# EAGLE design xenon_mini (EAGLE 9.4.2)
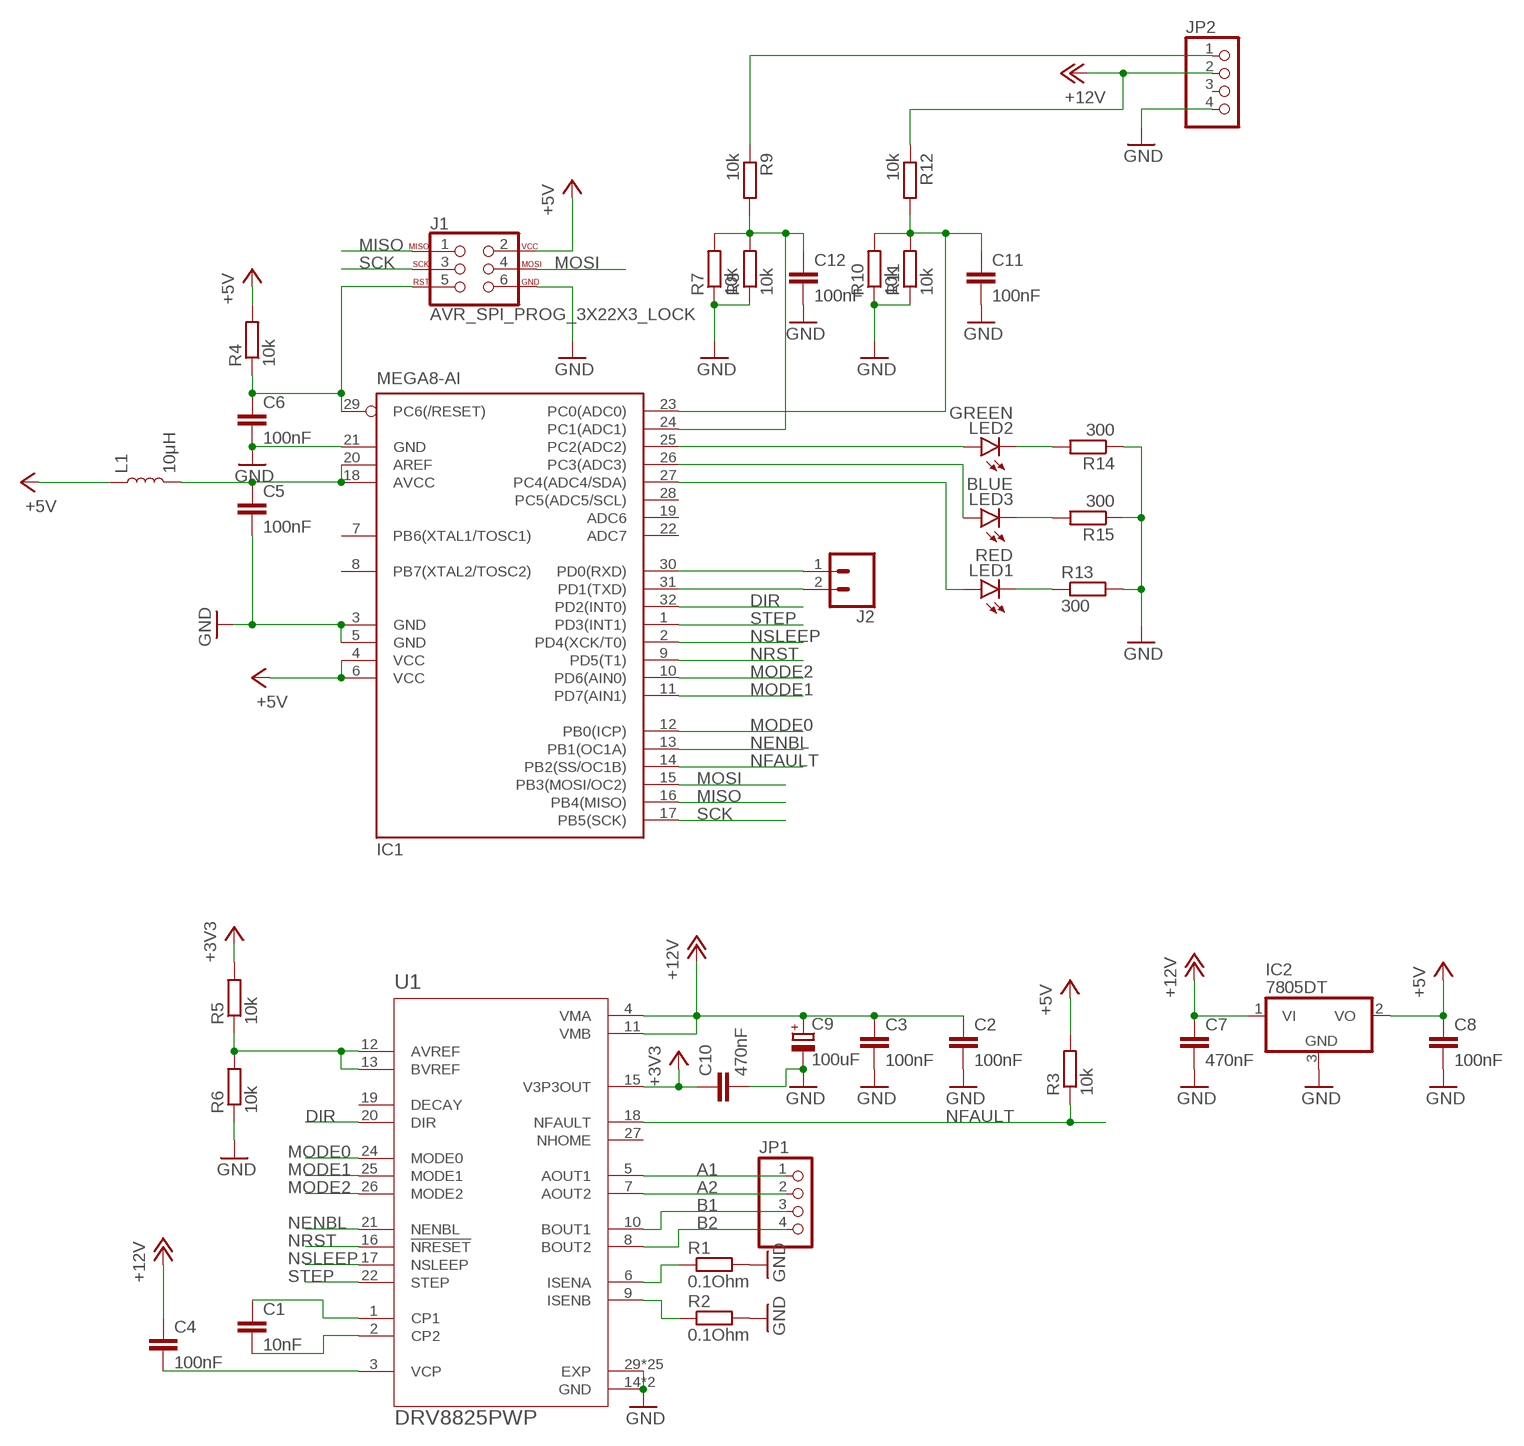
[diagram p0: schematic, sheet 1]

## Parts
C1  10nF  C-EUC0603  [C0603]
C2  100nF  C-EUC0603  [C0603]
C3  100nF  C-EUC0603  [C0603]
C4  100nF  C-EUC0603  [C0603]
C5  100nF  C-EUC0603  [C0603]
C6  100nF  C-EUC0603  [C0603]
C7  470nF  C-EUC0603  [C0603]
C8  100nF  C-EUC0603  [C0603]
C9  100uF  CPOL-EUUD-6,3X7,7  [UD-6,3X7,7_NICHICON]
C10  470nF  C-EUC0603  [C0603]
C11  100nF  C-EUC0603  [C0603]
C12  100nF  C-EUC0603  [C0603]
IC1  MEGA8-AI  [TQFP32-08]
IC2  7805DT  [TO252]
J1  AVR_SPI_PROG_3X22X3_LOCK  [2X3_LOCK]
J2  CONN_02LOCK  [1X02_LOCK]
JP1  PINHD-1X4  [1X04]
JP2  PINHD-1X4  [1X04]
L1  10μH  10μH_SHIELDED_INDUCTOR0805  [0805]
LED1  RED  LEDSML0603  [SML0603]
LED2  GREEN  LEDSML0603  [SML0603]
LED3  BLUE  LEDSML0603  [SML0603]
R1  0.1Ohm  R-EU_R1206  [R1206]
R2  0.1Ohm  R-EU_R1206  [R1206]
R3  10k  R-EU_R0603  [R0603]
R4  10k  R-EU_R0603  [R0603]
R5  10k  R-EU_R0603  [R0603]
R6  10k  R-EU_R0603  [R0603]
R7  10k  R-EU_R0603  [R0603]
R8  10k  R-EU_R0603  [R0603]
R9  10k  R-EU_R0603  [R0603]
R10  10k  R-EU_R0603  [R0603]
R11  10k  R-EU_R0603  [R0603]
R12  10k  R-EU_R0603  [R0603]
R13  300  R-EU_R0603  [R0603]
R14  300  R-EU_R0603  [R0603]
R15  300  R-EU_R0603  [R0603]
U1  DRV8825PWP  [SOP65P640X120-29N]

## Nets
+3V3: C10.1 R5.2 U1.15(V3P3OUT)
+5V: C8.1 IC1.4(VCC) IC1.6(VCC) IC2.2(VO) J1.2 L1.1 R3.2 R4.2
+12V: C2.1 C3.1 C4.1 C7.1 C9.+ IC2.1(VI) JP2.2 R12.1 U1.4(VMA) U1.11(VMB)
A1: JP1.1 U1.5(AOUT1)
A2: JP1.2 U1.7(AOUT2)
B1: JP1.3 U1.10(BOUT1)
B2: JP1.4 U1.8(BOUT2)
DIR: IC1.32(PD2(INT0)) U1.20(DIR)
GND: C2.2 C3.2 C5.2 C6.2 C7.2 C8.2 C9.- C10.2 C11.2 C12.2 IC1.3(GND) IC1.5(GND) IC1.21(GND) IC2.3(GND) J1.6 JP2.4 R1.2 R2.2 R6.1 R7.1 R8.1 R10.1 R11.1 R13.2 R14.1 R15.1 U1.14(GND) U1.28(GND) U1.29(EXP) U1.P1(EXP) U1.P2(EXP) U1.P3(EXP) U1.P4(EXP) U1.P5(EXP) U1.P6(EXP) U1.P7(EXP) U1.P8(EXP) U1.P9(EXP) U1.P10(EXP) U1.P11(EXP) U1.P12(EXP) U1.P13(EXP) U1.P14(EXP) U1.P15(EXP) U1.P16(EXP) U1.P17(EXP) U1.P18(EXP) U1.P19(EXP) U1.P20(EXP) U1.P21(EXP) U1.P22(EXP) U1.P23(EXP) U1.P24(EXP)
MISO: IC1.16(PB4(MISO)) J1.1
MODE0: IC1.12(PB0(ICP)) U1.24(MODE0)
MODE1: IC1.11(PD7(AIN1)) U1.25(MODE1)
MODE2: IC1.10(PD6(AIN0)) U1.26(MODE2)
MOSI: IC1.15(PB3(MOSI/OC2)) J1.4
N$1: C1.1 U1.1(CP1)
N$2: C1.2 U1.2(CP2)
N$3: C4.2 U1.3(VCP)
N$4: R1.1 U1.6(ISENA)
N$5: R2.1 U1.9(ISENB)
N$6: C6.1 IC1.29(PC6(/RESET)) J1.5 R4.1
N$7: C12.1 IC1.24(PC1(ADC1)) R7.2 R8.2 R9.2
N$8: C11.1 IC1.23(PC0(ADC0)) R10.2 R11.2 R12.2
N$9: LED1.C R13.1
N$10: JP2.1 R9.1
N$11: R5.1 R6.2 U1.12(AVREF) U1.13(BVREF)
N$12: IC1.30(PD0(RXD)) J2.1
N$13: IC1.31(PD1(TXD)) J2.2
N$14: IC1.25(PC2(ADC2)) LED2.A
N$15: IC1.26(PC3(ADC3)) LED3.A
N$16: LED2.C R14.2
N$17: LED3.C R15.2
N$18: IC1.27(PC4(ADC4/SDA)) LED1.A
N$19: C5.1 IC1.18(AVCC) IC1.20(AREF) L1.2
NENBL: IC1.13(PB1(OC1A)) U1.21(NENBL)
NFAULT: IC1.14(PB2(SS/OC1B)) R3.1 U1.18(NFAULT)
NRST: IC1.9(PD5(T1)) U1.16(!NRESET)
NSLEEP: IC1.2(PD4(XCK/T0)) U1.17(NSLEEP)
SCK: IC1.17(PB5(SCK)) J1.3
STEP: IC1.1(PD3(INT1)) U1.22(STEP)
Unconnected: IC1.7(PB6(XTAL1/TOSC1)) IC1.8(PB7(XTAL2/TOSC2)) IC1.19(ADC6) IC1.22(ADC7) IC1.28(PC5(ADC5/SCL)) JP2.3 U1.19(DECAY) U1.27(NHOME)

## Library data of the parts
C1 = rcl:C-EU: CAPACITOR, European symbol; LCSC: C57112; SPICEPREFIX: C
C2-C4 C8 = rcl:C-EU: CAPACITOR, European symbol; LCSC: C14663; SPICEPREFIX: C
C5 C6 C11 C12 = rcl:C-EU: CAPACITOR, European symbol; LCSC: CC0603KRX7R9BB104; SPICEPREFIX: C
C7 C10 = rcl:C-EU: CAPACITOR, European symbol; LCSC: C1623; SPICEPREFIX: C
C9 = rcl:CPOL-EU: POLARIZED CAPACITOR, European symbol; LCSC: C176675; SPICEPREFIX: C
IC1 = atmel:MEGA8: MICROCONTROLLER 8 Kbytes FLASH, 1 kbytes SRAM, 512 bytes EEPROM, USART, 6-channel 10 bit ADC, 2-channel 8 bit ADC Pin compatible with Atmega48, ATMega88, ATMega168 Source: avr.lbr; LCSC: C8727; MPN: ATMEGA8-16AU; OC_FARNELL: 9171371; OC_NEWARK: 73M8863
IC2 = linear:78*: Positive VOLTAGE REGULATOR Source: http://cache.national.com/ds/LM/LM78L05.pdf http://www.fairchildsemi.com/ds/LM/LM7805.pdf; LCSC: C310413
J1 = SparkFun-Connectors:AVR_SPI_PROG_3X2: AVR ISP 6 Pin This is the reduced ISP connector for AVR programming. Common on Arduino. This footprint will take up less PCB space and can be used with a 10-pin to 6-pin adapter such as SKU: BOB-08508 **Special note about "TEST_POINT" package. The stop mask is on the top side, so if you want your programming test points to be on the bottom of your board, make sure to place this package on the bottom side of the board. This also ensure that the orientation to program from the bottom side will be correct. SparkFun Products: SparkFun ISP Pogo Adapter <https://www.sparkfun.com/products/11591> - NS Tiny AVR Programmer <https://www.sparkfun.com/products/11801> -PTH
J2 = SparkFun-Connectors:CONN_02: Multi connection point. Often used as Generic Header-pin footprint for 0.1 inch spaced/style header connections On any of the 0.1 inch spaced packages, you can populate with these: Break Away Headers - Straight <https://www.sparkfun.com/products/116> (PRT-00116) Break Away Male Headers - Right Angle <https://www.sparkfun.com/products/553> (PRT-00553) Female Headers <https://www.sparkfun.com/products/115> (PRT-00115) Break Away Headers - Machine Pin <https://www.sparkfun.com/products/117> (PRT-00117) Break Away Female Headers - Swiss Machine Pin <https://www.sparkfun.com/products/743> (PRT-00743) For SCREWTERMINALS and SPRING TERMINALS visit here: Screw Terimnals on SparkFun.com <https://www.sparkfun.com/search/results?term=Screw+Terminals> (5mm/3.5mm/2.54mm spacing) This device is also useful as a general connection point to wire up your design to another part of your project. Our various solder wires solder well into these plated through hole pads. Hook-Up Wire - Assortment (Stranded, 22 AWG) <https://www.sparkfun.com/products/11375> (PRT-11375) Hook-Up Wire - Assortment (Solid Core, 22 AWG) <https://www.sparkfun.com/products/11367> (PRT-11367) View the entire wire category on our website here <https://www.sparkfun.com/categories/141> Special notes: Molex polarized connector foot print use with: PRT-08233 with associated crimp pins and housings. 2.54_SCREWTERM for use with PRT-10571. 3.5mm Screw Terminal footprints for PRT-08084 5mm Screw Terminal footprints for use with PRT-08432
JP1 JP2 = pinhead:PINHD-1X4: PIN HEADER
L1 = SparkFun-Coils:10μH_SHIELDED_INDUCTOR: Murata 10uH Inductor 10uH 60mA 400mOhm 0805 Package Shielded; LCSC: C1046; PROD_ID: NDUC-13231
LED1 = led:LED: LED OSRAM: - CHIPLED LG R971, LG N971, LY N971, LG Q971, LY Q971, LO R971, LY R971 LH N974, LH R974 LS Q976, LO Q976, LY Q976 LO Q996 - Hyper CHIPLED LW Q18S LB Q993, LB Q99A, LB R99A - SideLED LS A670, LO A670, LY A670, LG A670, LP A670 LB A673, LV A673, LT A673, LW A673 LH A674 LY A675 LS A676, LA A676, LO A676, LY A676, LW A676 LS A679, LY A679, LG A679 - Hyper Micro SIDELED® LS Y876, LA Y876, LO Y876, LY Y876 LT Y87S - SmartLED LW L88C, LW L88S LB L89C, LB L89S, LG L890 LS L89K, LO L89K, LY L89K LS L896, LA L896, LO L896, LY L896 - TOPLED LS T670, LO T670, LY T670, LG T670, LP T670 LSG T670, LSP T670, LSY T670, LOP T670, LYG T670 LG T671, LOG T671, LSG T671 LB T673, LV T673, LT T673, LW T673 LH T674 LS T676, LA T676, LO T676, LY T676, LB T676, LH T676, LSB T676, LW T676 LB T67C, LV T67C, LT T67C, LS T67K, LO T67K, LY T67K, LW E67C LS E67B, LA E67B, LO E67B, LY E67B, LB E67C, LV E67C, LT E67C LW T67C LS T679, LY T679, LG T679 LS T770, LO T770, LY T770, LG T770, LP T770 LB T773, LV T773, LT T773, LW T773 LH T774 LS E675, LA E675, LY E675, LS T675 LS T776, LA T776, LO T776, LY T776, LB T776 LHGB T686 LT T68C, LB T68C - Hyper Mini TOPLED® LB M676 - Mini TOPLED Santana® LG M470 LS M47K, LO M47K, LY M47K Source: http://www.osram.convergy.de LUXEON: - LUMILED® LXK2-PW12-R00, LXK2-PW12-S00, LXK2-PW14-U00, LXK2-PW14-V00 LXK2-PM12-R00, LXK2-PM12-S00, LXK2-PM14-U00 LXK2-PE12-Q00, LXK2-PE12-R00, LXK2-PE12-S00, LXK2-PE14-T00, LXK2-PE14-U00 LXK2-PB12-K00, LXK2-PB12-L00, LXK2-PB12-M00, LXK2-PB14-N00, LXK2-PB14-P00, LXK2-PB14-Q00 LXK2-PR12-L00, LXK2-PR12-M00, LXK2-PR14-Q00, LXK2-PR14-R00 LXK2-PD12-Q00, LXK2-PD12-R00, LXK2-PD12-S00 LXK2-PH12-R00, LXK2-PH12-S00 LXK2-PL12-P00, LXK2-PL12-Q00, LXK2-PL12-R00 Source: www.luxeon.com KINGBRIGHT: KA-3528ASYC Source: www.kingbright.com; LCSC: C2286
LED2 = led:LED: LED OSRAM: - CHIPLED LG R971, LG N971, LY N971, LG Q971, LY Q971, LO R971, LY R971 LH N974, LH R974 LS Q976, LO Q976, LY Q976 LO Q996 - Hyper CHIPLED LW Q18S LB Q993, LB Q99A, LB R99A - SideLED LS A670, LO A670, LY A670, LG A670, LP A670 LB A673, LV A673, LT A673, LW A673 LH A674 LY A675 LS A676, LA A676, LO A676, LY A676, LW A676 LS A679, LY A679, LG A679 - Hyper Micro SIDELED® LS Y876, LA Y876, LO Y876, LY Y876 LT Y87S - SmartLED LW L88C, LW L88S LB L89C, LB L89S, LG L890 LS L89K, LO L89K, LY L89K LS L896, LA L896, LO L896, LY L896 - TOPLED LS T670, LO T670, LY T670, LG T670, LP T670 LSG T670, LSP T670, LSY T670, LOP T670, LYG T670 LG T671, LOG T671, LSG T671 LB T673, LV T673, LT T673, LW T673 LH T674 LS T676, LA T676, LO T676, LY T676, LB T676, LH T676, LSB T676, LW T676 LB T67C, LV T67C, LT T67C, LS T67K, LO T67K, LY T67K, LW E67C LS E67B, LA E67B, LO E67B, LY E67B, LB E67C, LV E67C, LT E67C LW T67C LS T679, LY T679, LG T679 LS T770, LO T770, LY T770, LG T770, LP T770 LB T773, LV T773, LT T773, LW T773 LH T774 LS E675, LA E675, LY E675, LS T675 LS T776, LA T776, LO T776, LY T776, LB T776 LHGB T686 LT T68C, LB T68C - Hyper Mini TOPLED® LB M676 - Mini TOPLED Santana® LG M470 LS M47K, LO M47K, LY M47K Source: http://www.osram.convergy.de LUXEON: - LUMILED® LXK2-PW12-R00, LXK2-PW12-S00, LXK2-PW14-U00, LXK2-PW14-V00 LXK2-PM12-R00, LXK2-PM12-S00, LXK2-PM14-U00 LXK2-PE12-Q00, LXK2-PE12-R00, LXK2-PE12-S00, LXK2-PE14-T00, LXK2-PE14-U00 LXK2-PB12-K00, LXK2-PB12-L00, LXK2-PB12-M00, LXK2-PB14-N00, LXK2-PB14-P00, LXK2-PB14-Q00 LXK2-PR12-L00, LXK2-PR12-M00, LXK2-PR14-Q00, LXK2-PR14-R00 LXK2-PD12-Q00, LXK2-PD12-R00, LXK2-PD12-S00 LXK2-PH12-R00, LXK2-PH12-S00 LXK2-PL12-P00, LXK2-PL12-Q00, LXK2-PL12-R00 Source: www.luxeon.com KINGBRIGHT: KA-3528ASYC Source: www.kingbright.com; LCSC: C72043
LED3 = led:LED: LED OSRAM: - CHIPLED LG R971, LG N971, LY N971, LG Q971, LY Q971, LO R971, LY R971 LH N974, LH R974 LS Q976, LO Q976, LY Q976 LO Q996 - Hyper CHIPLED LW Q18S LB Q993, LB Q99A, LB R99A - SideLED LS A670, LO A670, LY A670, LG A670, LP A670 LB A673, LV A673, LT A673, LW A673 LH A674 LY A675 LS A676, LA A676, LO A676, LY A676, LW A676 LS A679, LY A679, LG A679 - Hyper Micro SIDELED® LS Y876, LA Y876, LO Y876, LY Y876 LT Y87S - SmartLED LW L88C, LW L88S LB L89C, LB L89S, LG L890 LS L89K, LO L89K, LY L89K LS L896, LA L896, LO L896, LY L896 - TOPLED LS T670, LO T670, LY T670, LG T670, LP T670 LSG T670, LSP T670, LSY T670, LOP T670, LYG T670 LG T671, LOG T671, LSG T671 LB T673, LV T673, LT T673, LW T673 LH T674 LS T676, LA T676, LO T676, LY T676, LB T676, LH T676, LSB T676, LW T676 LB T67C, LV T67C, LT T67C, LS T67K, LO T67K, LY T67K, LW E67C LS E67B, LA E67B, LO E67B, LY E67B, LB E67C, LV E67C, LT E67C LW T67C LS T679, LY T679, LG T679 LS T770, LO T770, LY T770, LG T770, LP T770 LB T773, LV T773, LT T773, LW T773 LH T774 LS E675, LA E675, LY E675, LS T675 LS T776, LA T776, LO T776, LY T776, LB T776 LHGB T686 LT T68C, LB T68C - Hyper Mini TOPLED® LB M676 - Mini TOPLED Santana® LG M470 LS M47K, LO M47K, LY M47K Source: http://www.osram.convergy.de LUXEON: - LUMILED® LXK2-PW12-R00, LXK2-PW12-S00, LXK2-PW14-U00, LXK2-PW14-V00 LXK2-PM12-R00, LXK2-PM12-S00, LXK2-PM14-U00 LXK2-PE12-Q00, LXK2-PE12-R00, LXK2-PE12-S00, LXK2-PE14-T00, LXK2-PE14-U00 LXK2-PB12-K00, LXK2-PB12-L00, LXK2-PB12-M00, LXK2-PB14-N00, LXK2-PB14-P00, LXK2-PB14-Q00 LXK2-PR12-L00, LXK2-PR12-M00, LXK2-PR14-Q00, LXK2-PR14-R00 LXK2-PD12-Q00, LXK2-PD12-R00, LXK2-PD12-S00 LXK2-PH12-R00, LXK2-PH12-S00 LXK2-PL12-P00, LXK2-PL12-Q00, LXK2-PL12-R00 Source: www.luxeon.com KINGBRIGHT: KA-3528ASYC Source: www.kingbright.com; LCSC: C72041
R1 R2 = rcl:R-EU_: RESISTOR, European symbol; LCSC: C25334; SPICEPREFIX: R
R3-R12 = rcl:R-EU_: RESISTOR, European symbol; LCSC: C25804; SPICEPREFIX: R
R13-R15 = rcl:R-EU_: RESISTOR, European symbol; LCSC: C23025; SPICEPREFIX: R
U1 = DRV8825PWP:DRV8825PWP: 2.5A Bipolar Stepper Motor Driver with On-Chip 1/32 Microstepping Indexer (Step/Dir Ctrl) 28-HTSSOP -40 to 85; AVAILABILITY: Unavailable; DESCRIPTION: 45-V, 2.5-A bipolar stepper motor driver with current regulation and 1/32 microstepping 28-HTSSOP -40 to 85; LCSC: C81582; MF: Texas Instruments; MP: DRV8825PWP; PACKAGE: HTSSOP-28 Texas Instruments; PRICE: None; TEXAS_INSTRUMENTS-PURCHASE-URL: https://snapeda.com/shop?store=Texas+Instruments&id=52585

## Board
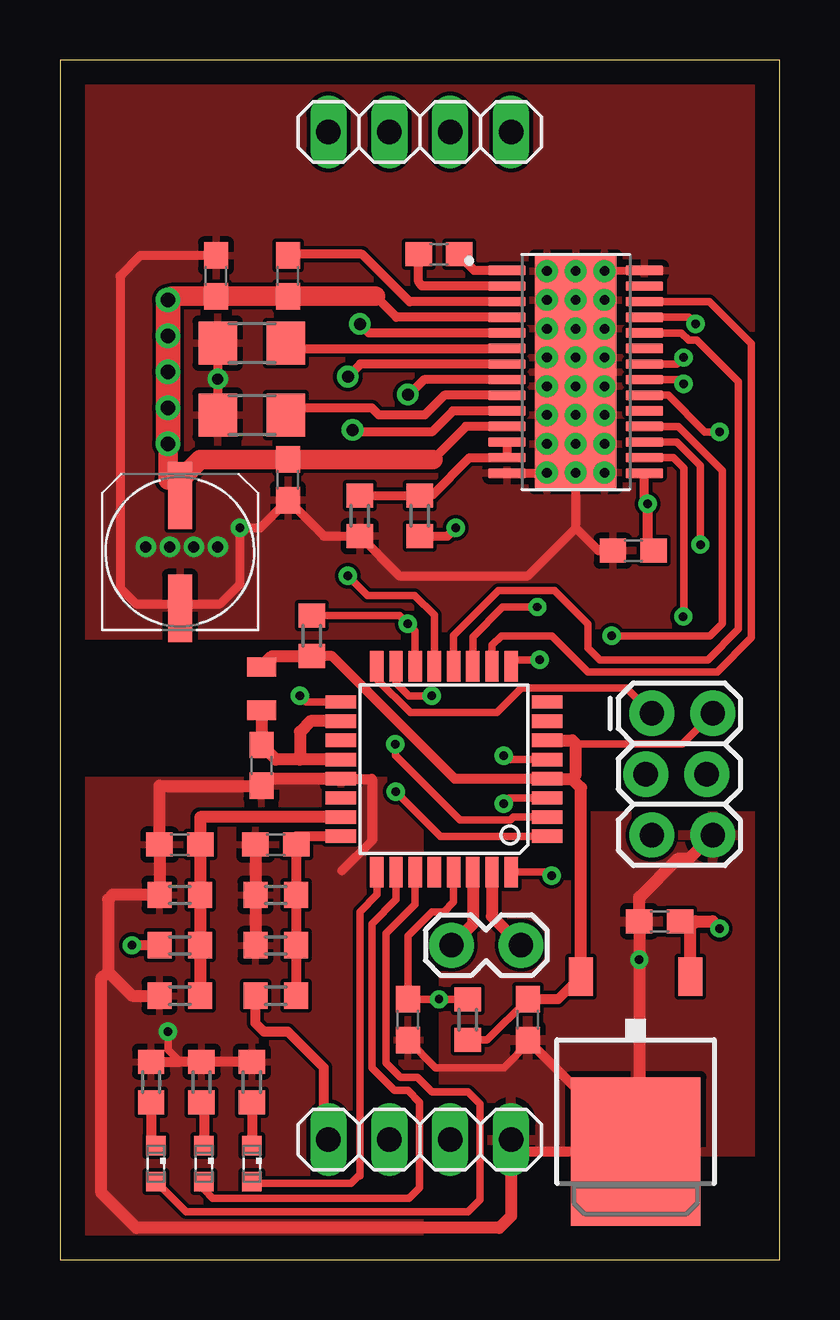
[diagram p1: board, top side]
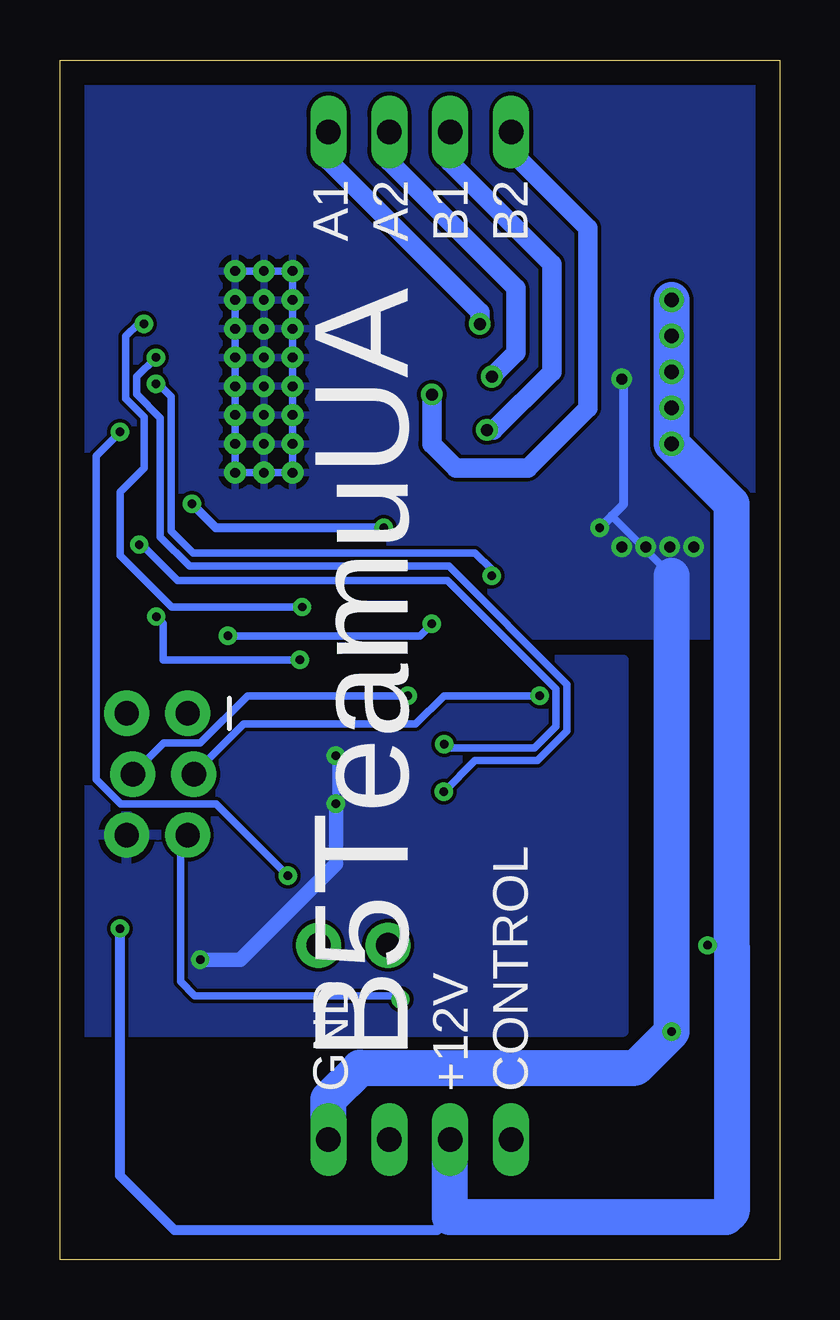
[diagram p2: board, bottom side, seen from below]

Size 30 x 50 mm. Coordinates in mm from the lower left corner, seen from the top.
Outline: 0,0 30,0 30,50 0,50 0,0
Copper layers (1*16): Top 0.035mm / dielectric 1.5mm / Bottom 0.035mm
Design rules "default": minimum track width 6mil, minimum drill 0.35mm, track to track 6mil, track to pad 6mil, pad to pad 6mil, via to via 6mil, smd to smd 6mil, copper to edge 40mil, drill to drill 6mil, minimum pad ring 10mil, minimum via ring 8mil, stop-mask expansion 4mil, vias tented up to drill 0mil, thermal gap 10mil

### Footprints (pad centres in the part's own frame; a part is rotated, then mirrored left to right if it is on the bottom)
C0603 = smd 1.1 x 1: 1 -0.85,0; 2 0.85,0
UD-6,3X7,7_NICHICON = smd 2.8 x 1: + 2.35,0; - -2.35,0
TQFP32-08 = smd 1.27 x 0.559: 1 -4.293,2.8; 2 -4.293,2; 3 -4.293,1.2; 4 -4.293,0.4; 5 -4.293,-0.4; 6 -4.293,-1.2; 7 -4.293,-2; 8 -4.293,-2.8; 17 4.293,-2.8; 18 4.293,-2; 19 4.293,-1.2; 20 4.293,-0.4; 21 4.293,0.4; 22 4.293,1.2; 23 4.293,2; 24 4.293,2.8 | smd 0.559 x 1.27: 9 -2.8,-4.293; 10 -2,-4.293; 11 -1.2,-4.293; 12 -0.4,-4.293; 13 0.4,-4.293; 14 1.2,-4.293; 15 2,-4.293; 16 2.8,-4.293; 25 2.8,4.293; 26 2,4.293; 27 1.2,4.293; 28 0.4,4.293; 29 -0.4,4.293; 30 -1.2,4.293; 31 -2,4.293; 32 -2.8,4.293
TO252 = smd 1 x 1.6: 1 -2.28,-4.8; 2 2.28,-4.8 | smd 5.4 x 6.2: 3 0,2.5
2X3_LOCK = drill 1.016 pad 1.88: 1 0,0.127; 2 0,2.667; 3 2.54,-0.127; 4 2.54,2.413; 5 5.08,0.127; 6 5.08,2.667
1X02_LOCK = drill 1.016 pad 1.88: 1 -0.178,0; 2 2.718,0
1X04 = drill 1.016 long: 1 -3.81,0; 2 -1.27,0; 3 1.27,0; 4 3.81,0
0805 = smd 0.8 x 1.2: 1 -0.9,0; 2 0.9,0
SML0603 = smd 0.8 x 0.8: A 0.75,0; C -0.75,0
R1206 = smd 1.6 x 1.803: 1 -1.422,0; 2 1.422,0
R0603 = smd 1 x 1.1: 1 -0.85,0; 2 0.85,0
SOP65P640X120-29N = smd 1.57 x 0.41: 1 -2.87,4.225; 2 -2.87,3.575; 3 -2.87,2.925; 4 -2.87,2.275; 5 -2.87,1.625; 6 -2.87,0.975; 7 -2.87,0.325; 8 -2.87,-0.325; 9 -2.87,-0.975; 10 -2.87,-1.625; 11 -2.87,-2.275; 12 -2.87,-2.925; 13 -2.87,-3.575; 14 -2.87,-4.225; 15 2.87,-4.225; 16 2.87,-3.575; 17 2.87,-2.925; 18 2.87,-2.275; 19 2.87,-1.625; 20 2.87,-0.975; 21 2.87,-0.325; 22 2.87,0.325; 23 2.87,0.975; 24 2.87,1.625; 25 2.87,2.275; 26 2.87,2.925; 27 2.87,3.575; 28 2.87,4.225 | smd 3.4 x 9.7: 29 0,0 | drill 0.4: P1 -1.2,0.6; P2 0,0.6; P3 1.2,0.6; P4 -1.2,-0.6; P5 0,-0.6; P6 1.2,-0.6; P7 -1.2,-1.8; P8 0,-1.8; P9 1.2,-1.8; P10 -1.2,-3; P11 0,-3; P12 1.2,-3; P13 -1.2,-4.2; P14 0,-4.2; P15 1.2,-4.2; P16 -1.2,1.8; P17 0,1.8; P18 1.2,1.8; P19 -1.2,3; P20 0,3; P21 1.2,3; P22 -1.2,4.2; P23 0,4.2; P24 1.2,4.2

### Placement (x,y rotation side)
C1  15.8,41.9 180 top
C2  6.5,41 90 top
C3  9.5,32.5 270 top
C4  9.5,41 90 top
C5  8.4,20.6 270 top
C6  14.5,10 270 top
C7  25,14.1 180 top
C8  19.5,10 270 top
C9  5,29.5 90 top
C10  23.9,29.55 180 top
C11  5,17.3 180 top
C12  9,17.3 180 top
IC1  16.01,20.44 180 top
IC2  24,7 180 top
J1  24.55,22.77 270 top
J2  16.5,13.1 0 top
JP1  15,47 180 top
JP2  15,5 0 top
L1  8.4,23.8 270 top
LED1  4,4 270 top
LED2  8,4 270 top
LED3  6,4 270 top
R1  8,38.2 180 top
R2  8,35.2 180 top
R3  10.5,26 270 top
R4  17,10 270 top
R5  15,31 270 top
R6  12.5,31 90 top
R7  9,15.2 0 top
R8  9,13.1 0 top
R9  9,11 0 top
R10  5,11 0 top
R11  5,15.2 0 top
R12  5,13.1 0 top
R13  3.8,7.4 90 top
R14  8,7.4 270 top
R15  5.9,7.4 270 top
U1  21.5,37 0 top

### Tracks (layer width: path | path; a pad name or v marks a point on that pad's centre or on a via)
+3V3  (via drill 0.35)
  Top 0.381: R5.2 16.15,30.15 v16.5,30.5 | v24.5,31.5 24.37,31.63 U1.15
  Top 0.406: C10.1 24.5,29.8 v24.5,31.5
  Bottom 0.381: v16.5,30.5 23.5,30.5 v24.5,31.5
+5V
  Top 0.305: R4.2 17.8,9.15 C8.1 | 21.5,21.5 25.95,21.5 J1.2
  Top 0.406: IC2.2 20.77,10.85 C8.1 | R3.2 11.35,25.15 16.46,20.04 IC1.4
  Top 0.508: L1.1 8.85,25.15 R3.2 | IC1.6 21.36,21.64 21.5,21.5 21.5,20.2 21.34,20.04 | IC1.4 21.34,20.04 | IC2.2 21.72,19.66 21.34,20.04
+12V  (via drill 0.35, 0.6)
  Top 0.381: U1.11 16.93,34.73 15.55,33.35 | U1.4 14.03,39.27 13.15,40.15 | 5,32.5 5,32 | 5,32 C9.+ | 4.5,32.5 5,32
  Top 0.406: R12.1 v3,13.1
  Top 0.508: C7.1 26.5,14.1 | 26.5,14.1 27.2,14.1 v27.5,13.8 | IC2.1 26.28,13.88 26.5,14.1
  Top 0.813: 15.55,33.35 C3.1 5.85,33.35 5,32.5 | 13.15,40.15 C4.1 C2.1 4.65,40.15 v4.5,40 | v4.5,34 4.5,32.5
  Top 1.016: v4.5,40 v4.5,38.5 v4.5,37 v4.5,35.5 v4.5,34
  Bottom 0.406: v3,13.1 2,13.1 | JP2.2 13.73,1.77 14.28,1.22 25.22,1.22 27.5,3.5 v27.5,13.8
  Bottom 1.5: JP2.2 13.75,4.98 13.75,1.77 2.23,1.77 2,2 2,13.1 2,31.5 v4.5,34 v4.5,40
A1  (via drill 0.5)
  Top 0.381: U1.5 12.88,38.62 v12.5,39
  Bottom 0.813: v12.5,39 12.5,39.5 18.81,45.81 JP1.1
A2  (via drill 0.5)
  Top 0.381: U1.7 12.53,37.33 v12,36.8
  Bottom 0.813: v12,36.8 11,37.8 11,40.5 16.27,45.77 JP1.2
B1  (via drill 0.5)
  Top 0.381: U1.10 16.38,35.38 15.5,34.5 12.2,34.5 v12.2,34.58
  Bottom 0.813: v12.2,34.58 11.92,34.58 9.5,37 9.5,41.5 13.73,45.73 JP1.3
B2  (via drill 0.5)
  Top 0.381: U1.8 15.18,36.67 14.56,36.06 v14.5,36.06
  Bottom 0.813: v14.5,36.06 14.5,34 13.5,33 10.5,33 8,35.5 8,43 11.19,46.19 JP1.4
DIR  (via drill 0.35)
  Top 0.305: IC1.32 20.35,16.15 v20.5,16 | v27.5,34.5 26.89,34.5 25.37,36.02 U1.20
  Bottom 0.305: v20.5,16 23.48,18.98 27.48,18.98 28.5,20.01 28.5,33.5 v27.5,34.5
GND  (via drill 0.35, 0.45)
  Top 0.305: C6.2 15.65,8 18.5,8 19.57,9.07 | IC1.3 18.74,19.24 v18.5,19 | IC1.5 18.66,20.84 v18.5,21 | 5,8.25 4.5,8.75 v4.5,9.5 | U1.28 22.73,41.23 U1.P24 | U1.29 U1.P17 | U1.29 U1.P5 | U1.29 U1.P8 | U1.29 U1.P11 | U1.29 U1.P14 | C10.2 22.45,29.55
  Top 0.381: R1.2 v6.58,36.7 R2.2 | C9.- 5.17,27.32 | 21.5,30.5 19.5,28.5 14.15,28.5 R6.1 11,30.15 C3.2 8.35,30.5 v7.5,30.5 7.5,28.15 6.67,27.32 5.17,27.32 | 21.5,30.5 U1.P14 | C2.2 3.35,41.85 2.5,41 2.5,28 3.17,27.32 5.17,27.32 | 22.45,29.55 21.5,30.5 | U1.14 20.27,32.77 U1.P13 | 13,17.45 11.74,16.2
  Top 0.406: R15.1 R14.1 5,8.25 R13.2 | JP2.4 19.31,4.5 IC2.3 24,7 21.65,7 19.57,9.07 C8.2 | IC1.21 13,20.04 13,17.45
  Top 0.508: 2,12 2,15 2.2,15.2 R11.1 C11.2 4.15,19.75 C5.2 8.69,20.04 IC1.21 | 2,12 3,11 R10.1 | R8.1 R7.1 C12.2 | JP2.4 18.81,1.81 18.32,1.32 3.18,1.32 1.72,2.78 1.72,11.72 2,12 | IC2.3 24.15,4.65 v24.15,12.5 C7.2 24.15,15.1 25.74,16.69 26.22,16.69 J1.6
  Bottom 0.305: v18.5,19 v18.5,21 | 4.5,28.5 7,31 | U1.P24 U1.P23 U1.P22 U1.P19 U1.P16 U1.P1 U1.P4 U1.P7 U1.P10 U1.P13 U1.P14 U1.P15 U1.P12 U1.P9 U1.P6 U1.P3 U1.P18 U1.P21
  Bottom 0.381: v7.5,30.5 7,31 6.5,31.5 6.5,36.7 v6.58,36.7
  Bottom 0.61: v24.15,12.5 22.5,12.5 18.5,16.5 v18.5,19
  Bottom 1.5: JP2.4 18.81,6.69 17.5,8 6,8 v4.5,9.5 4.5,28.5
  other vias: 3.58,29.7 4.58,29.7 5.58,29.7 6.58,29.7
  pour Bottom: -1,50.5 -1,26 31,26 31,50.5
  pour Top: -2.5,50 32.5,50 32.5,26 -2.5,26
  pour Top: 16,18.5 30.5,18.5 30.5,4.5 16,4.5
  pour Top: -0.5,20 15,20 15,-0.5 -0.5,-0.5
  pour Bottom: 6.5,25 32.5,25 32.5,9.5 6.5,9.5
MISO
  Top 0.305: IC1.16 13.21,24.19 14.6,22.79 18.22,22.79 19.25,23.82 23.62,23.82 J1.1
MODE0
  Top 0.305: IC1.12 16.41,26.01 18.28,27.88 20.62,27.88 22,26.5 22,25.5 22.5,25 27,25 28.27,26.27 28.27,36.6 26.56,38.32 26.22,38.32 25.91,38.62 U1.24
MODE1  (via drill 0.35)
  Top 0.305: v19.9,27.2 18.45,27.2 17.21,25.96 IC1.11 | U1.25 26.23,39.27 v26.5,39
  Bottom 0.305: v19.9,27.2 25.35,27.2 27.5,29.35 27.5,32 26.5,33 26.5,35.12 27.26,35.88 27.26,38.49 26.75,39 v26.5,39
MODE2
  Top 0.305: U1.26 27.07,39.92 28.83,38.17 28.83,25.93 27.4,24.5 22,24.5 20.5,26 18.4,26 18.01,25.61 IC1.10
MOSI  (via drill 0.35)
  Top 0.305: v15.5,23.5 14.54,23.5 14.01,24.03 IC1.15
  Bottom 0.305: J1.4 25.67,21.52 24.16,21.52 22.19,23.5 v15.5,23.5
N$1
  Top 0.381: U1.1 17.27,41.23 16.65,41.85 C1.1
N$2
  Top 0.381: U1.2 15.09,40.58 14.95,40.75 C1.2
N$3
  Top 0.381: U1.3 14.57,39.92 12.6,41.9 9.55,41.9 C4.2
N$4
  Top 0.381: R1.1 9.9,38.2 10.13,37.98 U1.6
N$5
  Top 0.381: U1.9 16.02,36.02 15.2,35.2 13.3,35.2 13,35.5 10,35.5 R2.1
N$6  (via drill 0.35)
  Top 0.305: IC1.29 16.41,14.91 16,14.5 15.5,14.5 14.5,13.5 C6.1 v15.8,10.85 R4.1
  Bottom 0.305: J1.5 24.96,17.41 24.96,11.58 24.38,11 15.8,11 v15.8,10.85
N$7
  Top 0.406: R9.2 R8.2 R7.2 C12.1 9.85,17.64 IC1.24
N$8
  Top 0.508: R10.2 R12.2 R11.2 C11.1 5.85,18.44 IC1.23
N$9
  Top 0.406: LED1.C 3.8,4.95 R13.1
N$10
  Top 0.406: JP2.1 11,5.19 11,8 9.5,9.5 8.5,9.5 8.15,9.85 R9.1
N$11
  Top 0.381: U1.12 U1.13 17.07,33.42 15.5,31.85 R5.1 R6.2
N$12
  Top 0.508: IC1.30 17.21,13.99 J2.1
N$13
  Top 0.508: IC1.31 18.01,14.31 J2.2
N$14
  Top 0.305: LED2.A 8,3.17 12.13,3.17 12.46,3.5 12.5,3.5 12.5,14.5 13.21,15.21 IC1.25
N$15
  Top 0.305: LED3.A 6,2.92 6.37,2.54 14.55,2.54 15,3 15,6.56 14.51,7.05 13.95,7.05 13,8 13,14 14,15 IC1.26
N$16
  Top 0.406: R14.2 LED2.C
N$17
  Top 0.406: R15.2 6,6.45 LED3.C
N$18
  Top 0.305: LED1.A 5.25,2 17,2 17.5,2.5 17.5,6.5 17,7 15.5,7 14.9,7.6 14.2,7.6 13.6,8.2 13.6,13.6 14.81,14.81 IC1.27
N$19
  Top 0.508: IC1.20 10,20.84 | 10,20.84 9.01,20.84 C5.1 L1.2 | IC1.18 10.44,22.44 10,22 10,20.84
NENBL  (via drill 0.35)
  Top 0.305: U1.21 25.82,36.67 v26,36.5 | IC1.13 15.61,26.86 14.78,27.68 12.82,27.68 v12,28.5
  Bottom 0.305: v26,36.5 25.89,36.5 25.36,35.97 25.36,30.36 24.46,29.46 12.7,29.46 12,28.76 v12,28.5
NFAULT  (via drill 0.35)
  Top 0.305: U1.18 25.77,34.73 27.61,32.9 27.61,26.5 27.1,26 v23,26 | IC1.14 14.81,26.19 v14.5,26.5 14.15,26.85 R3.1
  Bottom 0.305: v23,26 15,26 v14.5,26.5
NRST  (via drill 0.35)
  Top 0.305: IC1.9 18.81,25 v20,25 | v25.98,26.8 26,26.82 26,33 25.57,33.42 U1.16
  Bottom 0.305: v20,25 25.7,25 25.7,26.52 v25.98,26.8
NSLEEP  (via drill 0.35)
  Top 0.305: IC1.2 18.91,18.44 18.78,18.32 16.68,18.32 13.98,21.02 v13.98,21.48 | U1.17 25.73,34.08 26.7,33.1 v26.7,29.8
  Bottom 0.305: v13.98,21.48 13.82,21.32 10.22,21.32 9.32,22.22 9.32,23.78 13.83,28.3 25.1,28.3 26.6,29.8 v26.7,29.8
SCK  (via drill 0.35)
  Top 0.305: IC1.17 10.26,23.24 v10,23.5
  Bottom 0.305: v10,23.5 14,23.5 15.18,22.32 22.34,22.32 J1.3
STEP  (via drill 0.35)
  Top 0.305: IC1.1 15.86,17.64 v14,19.5 | U1.22 25.73,37.33 v26,37.6
  Bottom 0.305: v14,19.5 12.7,20.8 10.09,20.8 8.86,22.03 8.86,23.97 13.79,28.9 24.6,28.9 25.82,30.12 25.82,35.08 26.8,36.07 26.8,36.8 v26,37.6

### Text on the board
bNames: B2 | B1 | A2 | A1 | B5TeamuUA | CONTROL | +12V | GND